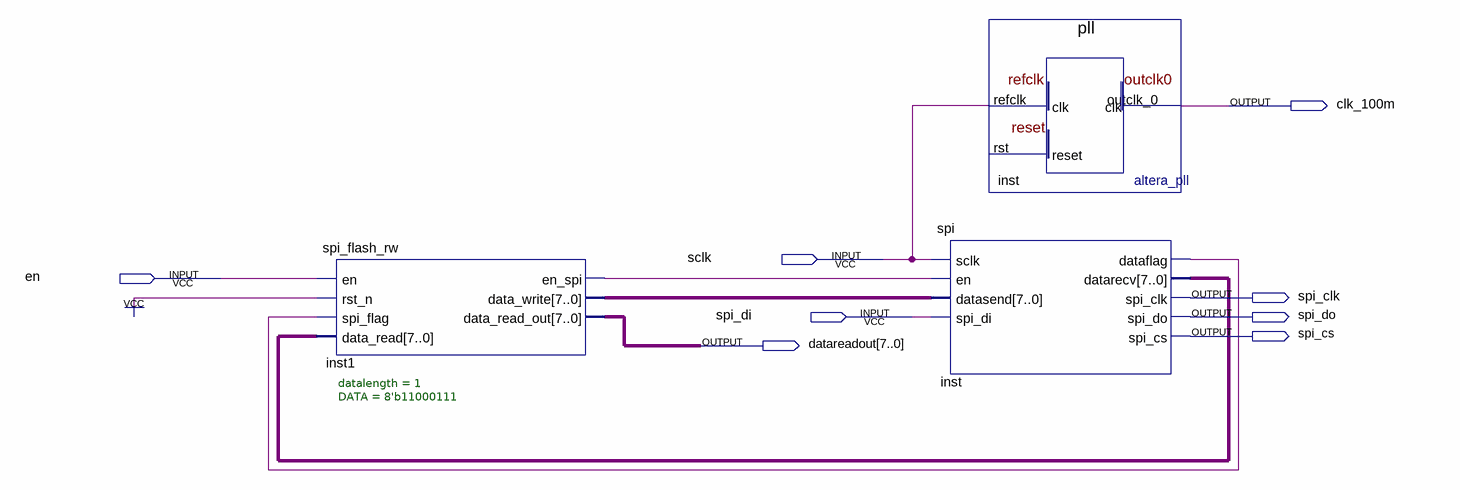
[diagram p0: schematic sheet]
// Quartus schematic flash.bdf as structural Verilog: 3 symbols, 8 pins
module flash (
  input  sclk,
  input  en,
  input  spi_di,
  output clk_100m,
  output spi_clk,
  output spi_do,
  output spi_cs,
  output [7:0] datareadout
);

  wire inst1_en_spi, inst_dataflag;
  wire [7:0] inst1_data_write, inst_datarecv;

  spi_flash_rw #(.datalength(1), .DATA(8'b11000111)) inst1 (
    .en(en), .rst_n(1'b1), .spi_flag(inst_dataflag), .data_read(inst_datarecv), .en_spi(inst1_en_spi),
    .data_write(inst1_data_write), .data_read_out(datareadout));
  spi inst (
    .sclk(sclk), .en(inst1_en_spi), .datasend(inst1_data_write), .spi_di(spi_di), .dataflag(inst_dataflag),
    .datarecv(inst_datarecv), .spi_clk(spi_clk), .spi_do(spi_do), .spi_cs(spi_cs));
  pll inst_dup2 (.refclk(sclk), .outclk_0(clk_100m));  // open: rst
endmodule
